# Altium schematic sheet 4_Resistor_Sensor.SchDoc
size A4
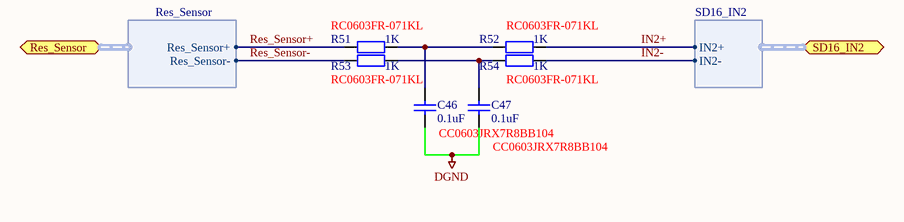
[diagram p0: 4_Resistor_Sensor.SchDoc]

## Parts
C46  0.1uF  Type No.: CC0603JRX7R8BB104  [CC0603]
C47  0.1uF  Type No.: CC0603JRX7R8BB104  [CC0603]
R51  1K  Type No.: RC0603FR-071KL  [CC0603]
R52  1K  Type No.: RC0603FR-071KL  [CC0603]
R53  1K  Type No.: RC0603FR-071KL  [CC0603]
R54  1K  Type No.: RC0603FR-071KL  [CC0603]

## Ports
Res_Sensor (harness Res_Sensor), SD16_IN2 (harness SD16_IN2)

## Harnesses
SD16_IN2: IN2+, IN2-
Res_Sensor: Res_Sensor+, Res_Sensor-

## Nets
DGND: C46.2 C47.2
IN2+: R52.1 ; port SD16_IN2.IN2+
IN2-: R54.1 ; port SD16_IN2.IN2-
Res_Sensor+: R51.2 ; port Res_Sensor.Res_Sensor+
Res_Sensor-: R53.2 ; port Res_Sensor.Res_Sensor-
NetC46_1: C46.1 R51.1 R52.2
NetC47_1: C47.1 R53.1 R54.2

## Notes on the sheet
- 文件版本:
- 原理图名:
- 工 程  名:
- 绘       制:
- 审       核:
- 第   页，共    页
- 日       期:

## Library data of the parts
C46 C47 = Cap: Capacitor
R51-R54 = Res2: Resistor